# Altium schematic sheet PowerSupply.SchDoc
size A4
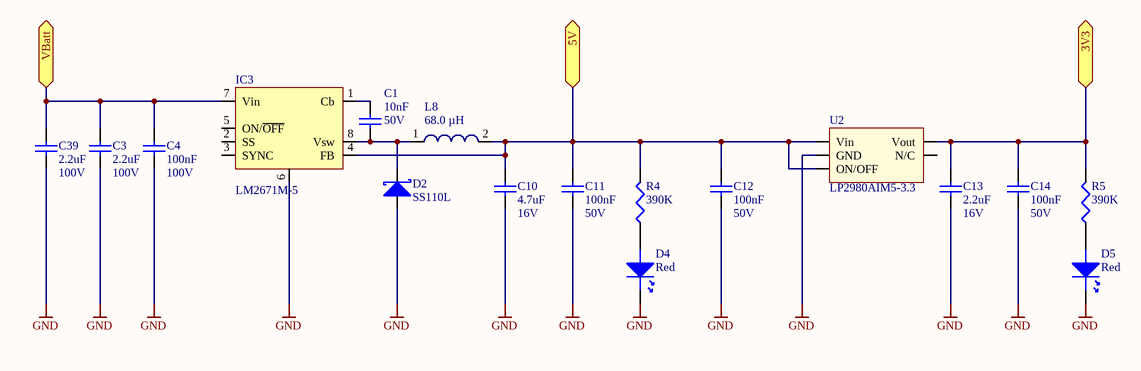
[diagram p0: PowerSupply.SchDoc]

## Parts
C1  10nF  Voltage Rating: 50V  [C0603]
C3  2.2uF  Voltage Rating: 100V  [C-1210]
C4  100nF  Voltage Rating: 100V  [C-1206]
C10  4.7uF  Voltage Rating: 16V  [C-0805]
C11  100nF  Voltage Rating: 50V  [C-0805]
C12  100nF  Voltage Rating: 50V  [C0603]
C13  2.2uF  Voltage Rating: 16V  [C0603]
C14  100nF  Voltage Rating: 50V  [C0603]
C39  2.2uF  Voltage Rating: 100V  [C-1210]
D2  SS110L  [SUB-SMA]
D4  Red  [D-0805]
D5  Red  [D-0805]
IC3  LM2671M-5  [SO-8]
L8  68.0 µH  [WE-LQ M]
R4  390K  [0603]
R5  390K  [0603]
U2  LP2980AIM5-3.3  [TSOT23]

## Ports
3V3, 5V, VBatt

## Nets
GND: C3.1 C4.1 C10.1 C11.1 C12.1 C13.1 C14.1 C39.1 D2.1(A) D4.K D5.K IC3.6(GND) U2.2(GND)
3V3: C13.2 C14.2 R5.2 U2.5(Vout) ; port 3V3
5V: C10.2 C11.2 C12.2 IC3.4(FB) L8.2 R4.2 U2.1(Vin) U2.3(ON/OFF) ; port 5V
VBatt: C3.2 C4.2 C39.2 IC3.7(Vin) ; port VBatt
NetC1_1: C1.1 D2.2(K) IC3.8(Vsw) L8.1
NetC1_2: C1.2 IC3.1(Cb)
NetD4_A: D4.A R4.1
NetD5_A: D5.A R5.1

Not connected (* = marked no-connect by the designer): IC3 2(SS) 3(SYNC) 5(ON/~{OFF}); U2 4(N/C)

## Library data of the parts
C1 = 10nF/0603/CER/50V: Capacitor, 10nF, 50V, X7R; Capacitance Tolerance: ± 10%; Capacitor Case Style: 0603; Brand Number: C0603C103K5RACTU; Brand: KEMET; Dielectric Characteristic: X7R; Capacitance: 10nF; Temperature Range: -55°C to +125°C; Price: 0,011; Order Code Supplier: 1414609; Supplier: Farnell
C3 C39 = 2.2uF/1210/CER/100V: Capacitor, 2.2uF, 100V, X7R; Capacitance Tolerance: ± 20%; Capacitor Case Style: 1210; Brand Number: C1210C225M1RACTU; Brand: KEMET; Dielectric Characteristic: X7R; Capacitance: 2.2uF; Temperature Range: -55°C to +125°C; Price: 0,64; Order Code Supplier: 1838747; Supplier: Farnell
C4 = 100nF/1206/CER/100V: Capacitor, 100nF, 100V, X7R; Capacitance Tolerance: ± 10%; Capacitor Case Style: 1206; Brand Number: C1206C104K1RACTU; Brand: KEMET; Dielectric Characteristic: X7R; Capacitance: 100nF; Temperature Range: -55°C to +125°C; Price: 0,079; Order Code Supplier: 1414714; Supplier: Farnell
C10 = 4.7uF/0805/CER/16V: Capacitor, 4.7uF, 16V, X7R; Capacitance Tolerance: ± 10%; Capacitor Case Style: 0805; Brand Number: GRM21BR71C475KA73L; Brand: MURATA; Dielectric Characteristic: X7R; Capacitance: 4.7uF; Temperature Range: -55°C to +125°C; Price: 0,26; Order Code Supplier: 1797015; Supplier: Farnell
C11 = 100nF/0805/CER/50V: Capacitor, 100nF, 50V,  X7R; Capacitance Tolerance: ± 10%; Capacitor Case Style: 0805; Brand Number: C0805C104K5RACTU; Brand: KEMET; Dielectric Characteristic: X7R; Capacitance: 100nF; Temperature Range: -55°C to +125°C; Price: 0,022; Order Code Supplier: 1414664; Supplier: Farnell
C12 C14 = 100nF/0603/CER/50V: Capacitor, 100nF, 50V, X7R; Capacitance Tolerance: ± 10%; Capacitor Case Style: 0603; Brand Number: MCCA000255; Brand: MULTICOMP; Dielectric Characteristic: X7R; Capacitance: 100nF; Temperature Range: -55°C to +125°C; Price: 0,008; Order Code Supplier: 1759122RL; Supplier: Farnell
C13 = 2.2uF/0603/CER/16V: Capacitor, 2.2uF, 16V, X5R; Capacitance Tolerance: +/- 10%; Capacitor Case Style: 0603; Brand Number: GRM188R61C225KE15D; Brand: MURATA; Dielectric Characteristic: X5R; Capacitance: 2.2uF; Temperature Range: -55°C to 85°C; Price: 0,077; Order Code Supplier: 1735526; Supplier: Farnell
D2 = SS110L: Diode Schottky, Vrrm: 100V, If: 1A, Vf: 0.9V; Brand: TAIWAN SEMICONDUCTOR; Case Style: SMF; Brand Number: SS110L; Forward Current: 1A; Forward Voltage: 0.9V; Order Code Supplier: 1559156; Price: 0,191; Supplier: Farnell; Temperature Range: -55°C to +150°C; Vrrm: 100V
D4 D5 = SML-211UTT86K: Led, Red, Li:2.5mcd, Vf:1.8V, If:0.02A; Brand: ROHM; Case Style: 0805; Forward Current: 0.02A; Forward Voltage: 1.8V; Luminous Intensity: 2.5mcd; Brand Number: SML-211UTT86K; Order Code Supplier: 1685056RL; Price: 0,29; Supplier: Farnell; Temperature Range: -30°C to +85°C
IC3 = LM2671M-5: 5V DC/DC Converter; Case Style: SOIC8; Brand Number: LM2671M-5.0/NOPB; Brand: TEXAS INSTRUMENTS; Supplier: Farnell; Price: 3,16; Order Code Supplier: 1469200
L8 = WE-LQ M, 744032680: SMD-RF-Inductor WE-LQ, L=68.0 µH; partNo: 744032680; Inductance: 68.0 µH; ComponentLink1Description: Manufacturer; ComponentLink1URL: http://www.we-online.de; Created by: Christin Zierenner; Created Date: May 2009; ComponentLink2Description: Datasheet; ComponentLink2URL: http://www.we-online.de/katalog/media/pdf/744032680.pdf
R4 R5 = 390K/0603/0100W/75V: Resistor, 390K, 1%, 0.1W, 75V, 50PPM, 0603; Brand: VISHAY DRALORIC; Brand Number: CRCW0603390KFKEA; Case Style: 0603; Order Code Supplier: 2122692; Power Rating: 0.1W; Price: 0,145; Resistance: 390K; Supplier: Farnell; Temperature Coefficient: ± 50PPM; Temperature Range: -55°C to +125°C; Voltage Rating: 75V
U2 = LP2980AIM5-3.3: LDO, Out Voltage: 3.3V/50mA Ultra Low-Dropout Regulator; Brand: National Semiconductor; Case Style: SOT-23; Order Code Supplier: 1212201; Price: 0,38; Brand Number: LP2980AIM5-3.3; Supplier: Farnell; Temperature Range: -40°C to +125°C